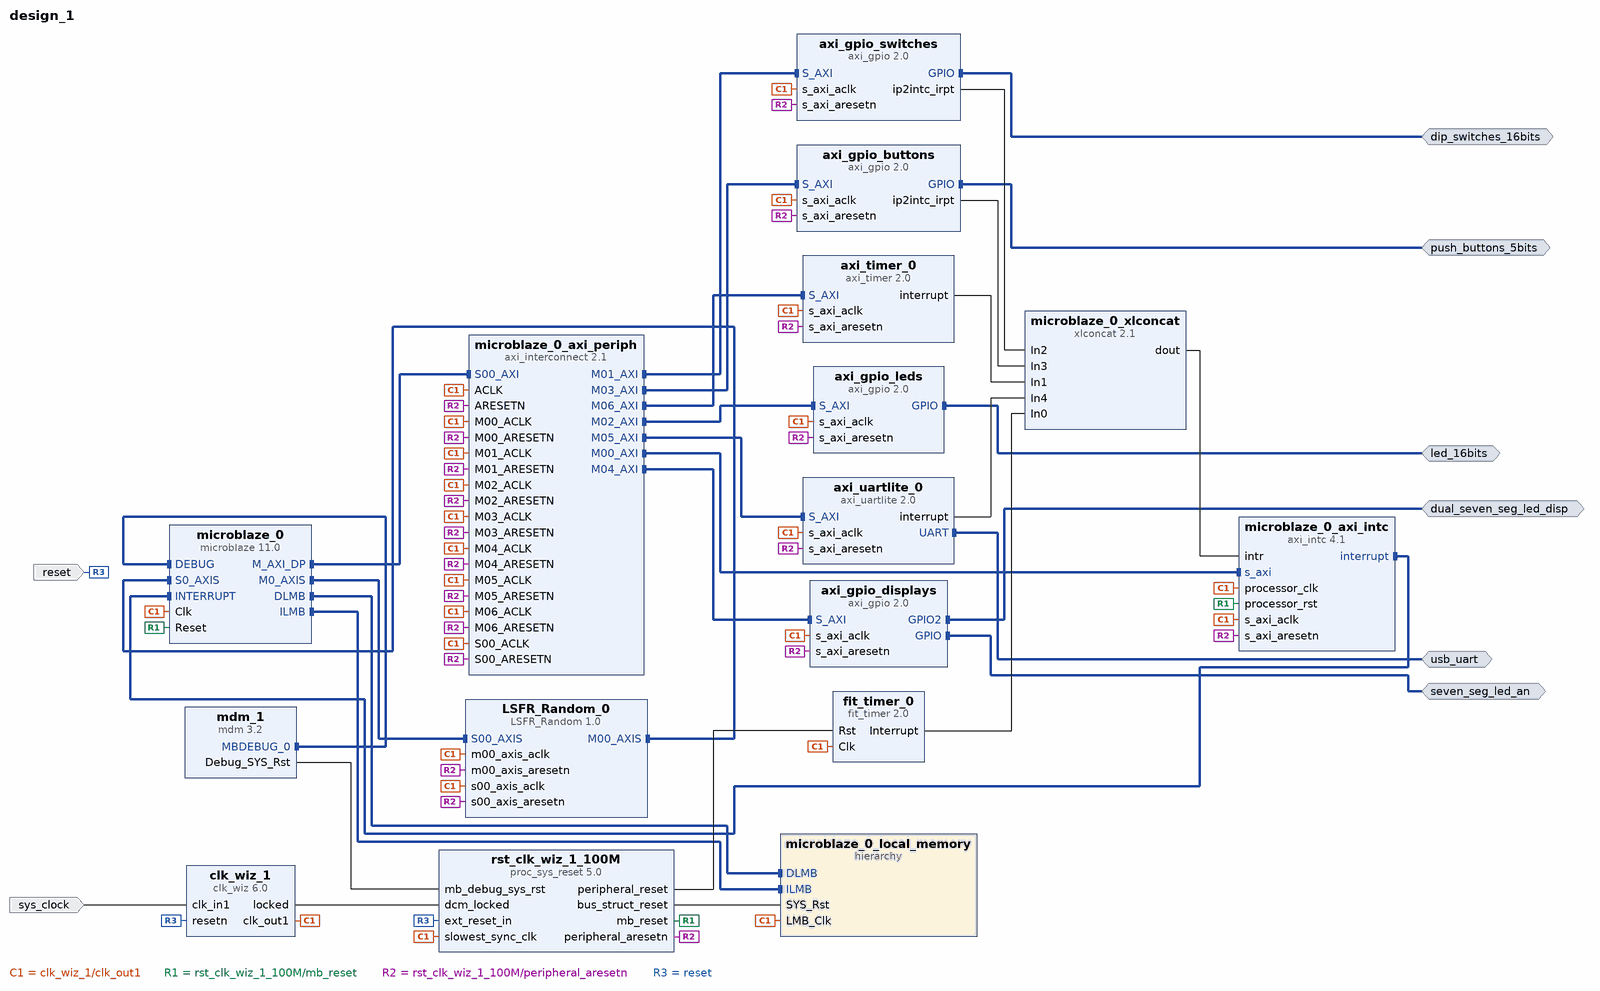
[diagram p0: block diagram of the top level]
# Vivado block design design_1, xc7a100tcsg324-1, Vivado 2020.2
create_bd_design design_1

create_bd_intf_port -mode Master -vlnv xilinx.com:interface:gpio_rtl:1.0 dip_switches_16bits
create_bd_intf_port -mode Master -vlnv xilinx.com:interface:gpio_rtl:1.0 led_16bits
create_bd_intf_port -mode Master -vlnv xilinx.com:interface:gpio_rtl:1.0 push_buttons_5bits
create_bd_intf_port -mode Master -vlnv xilinx.com:interface:gpio_rtl:1.0 seven_seg_led_an
create_bd_intf_port -mode Master -vlnv xilinx.com:interface:gpio_rtl:1.0 dual_seven_seg_led_disp
create_bd_intf_port -mode Master -vlnv xilinx.com:interface:uart_rtl:1.0 usb_uart
create_bd_port -dir I -type clk sys_clock
set_property -dict {CONFIG.FREQ_HZ 100000000 CONFIG.PHASE 0.000} [get_bd_ports sys_clock]
create_bd_port -dir I -type rst reset
set_property -dict {CONFIG.POLARITY ACTIVE_LOW} [get_bd_ports reset]

create_bd_cell -type ip -vlnv xilinx.com:ip:microblaze:11.0 microblaze_0
set_property -dict [list \
  CONFIG.C_DEBUG_ENABLED 1 \
  CONFIG.C_D_AXI 1 \
  CONFIG.C_D_LMB 1 \
  CONFIG.C_FSL_LINKS 1 \
  CONFIG.C_I_LMB 1 \
] [get_bd_cells microblaze_0]
create_bd_cell -type hier microblaze_0_local_memory
create_bd_cell -type ip -vlnv xilinx.com:ip:axi_interconnect:2.1 microblaze_0_axi_periph
set_property -dict {CONFIG.NUM_MI 7} [get_bd_cells microblaze_0_axi_periph]
create_bd_cell -type ip -vlnv xilinx.com:ip:axi_intc:4.1 microblaze_0_axi_intc
set_property -dict {CONFIG.C_HAS_FAST 1} [get_bd_cells microblaze_0_axi_intc]
create_bd_cell -type ip -vlnv xilinx.com:ip:xlconcat:2.1 microblaze_0_xlconcat
set_property -dict {CONFIG.NUM_PORTS 5} [get_bd_cells microblaze_0_xlconcat]
create_bd_cell -type ip -vlnv xilinx.com:ip:mdm:3.2 mdm_1
create_bd_cell -type ip -vlnv xilinx.com:ip:clk_wiz:6.0 clk_wiz_1
set_property -dict [list \
  CONFIG.CLK_IN1_BOARD_INTERFACE sys_clock \
  CONFIG.PRIM_SOURCE Single_ended_clock_capable_pin \
  CONFIG.RESET_BOARD_INTERFACE reset \
  CONFIG.RESET_PORT resetn \
  CONFIG.RESET_TYPE ACTIVE_LOW \
  CONFIG.USE_BOARD_FLOW true \
] [get_bd_cells clk_wiz_1]
create_bd_cell -type ip -vlnv xilinx.com:ip:proc_sys_reset:5.0 rst_clk_wiz_1_100M
set_property -dict {CONFIG.RESET_BOARD_INTERFACE reset CONFIG.USE_BOARD_FLOW true} [get_bd_cells rst_clk_wiz_1_100M]
create_bd_cell -type ip -vlnv xilinx.com:ip:axi_gpio:2.0 axi_gpio_switches
set_property -dict [list \
  CONFIG.C_INTERRUPT_PRESENT 1 \
  CONFIG.C_IS_DUAL 0 \
  CONFIG.GPIO_BOARD_INTERFACE dip_switches_16bits \
  CONFIG.USE_BOARD_FLOW true \
] [get_bd_cells axi_gpio_switches]
create_bd_cell -type ip -vlnv xilinx.com:ip:axi_gpio:2.0 axi_gpio_leds
set_property -dict {CONFIG.GPIO_BOARD_INTERFACE led_16bits CONFIG.USE_BOARD_FLOW true} [get_bd_cells axi_gpio_leds]
create_bd_cell -type ip -vlnv xilinx.com:ip:axi_gpio:2.0 axi_gpio_buttons
set_property -dict [list \
  CONFIG.C_INTERRUPT_PRESENT 1 \
  CONFIG.GPIO_BOARD_INTERFACE push_buttons_5bits \
  CONFIG.USE_BOARD_FLOW true \
] [get_bd_cells axi_gpio_buttons]
create_bd_cell -type ip -vlnv xilinx.com:ip:axi_gpio:2.0 axi_gpio_displays
set_property -dict [list \
  CONFIG.C_DOUT_DEFAULT 0xFFFFFFFF \
  CONFIG.C_DOUT_DEFAULT_2 0xFFFFFFFF \
  CONFIG.GPIO2_BOARD_INTERFACE dual_seven_seg_led_disp \
  CONFIG.GPIO_BOARD_INTERFACE seven_seg_led_an \
  CONFIG.USE_BOARD_FLOW true \
] [get_bd_cells axi_gpio_displays]
create_bd_cell -type ip -vlnv xilinx.com:ip:axi_uartlite:2.0 axi_uartlite_0
set_property -dict {CONFIG.UARTLITE_BOARD_INTERFACE usb_uart CONFIG.USE_BOARD_FLOW true} [get_bd_cells axi_uartlite_0]
create_bd_cell -type ip -vlnv xilinx.com:ip:axi_timer:2.0 axi_timer_0
set_property -dict {CONFIG.enable_timer2 0} [get_bd_cells axi_timer_0]
create_bd_cell -type ip -vlnv xilinx.com:ip:fit_timer:2.0 fit_timer_0
set_property -dict {CONFIG.C_NO_CLOCKS 125000} [get_bd_cells fit_timer_0]
create_bd_cell -type ip -vlnv xilinx.com:user:LSFR_Random:1.0 LSFR_Random_0

# ---- hierarchy /microblaze_0_local_memory ----
current_bd_instance /microblaze_0_local_memory
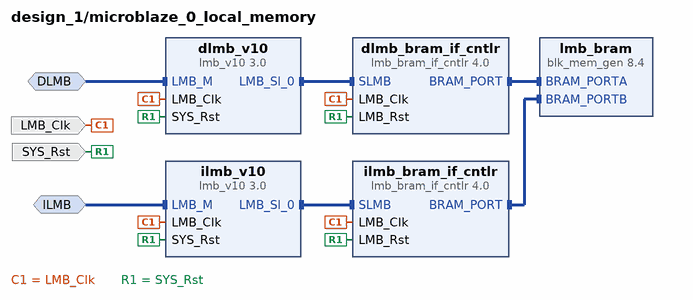
[diagram p1: block diagram inside /microblaze_0_local_memory]
create_bd_intf_pin -mode MirroredMaster -vlnv xilinx.com:interface:lmb_rtl:1.0 DLMB
create_bd_intf_pin -mode MirroredMaster -vlnv xilinx.com:interface:lmb_rtl:1.0 ILMB
create_bd_pin -dir I -type clk LMB_Clk
create_bd_pin -dir I -type rst SYS_Rst

create_bd_cell -type ip -vlnv xilinx.com:ip:lmb_v10:3.0 dlmb_v10
create_bd_cell -type ip -vlnv xilinx.com:ip:lmb_v10:3.0 ilmb_v10
create_bd_cell -type ip -vlnv xilinx.com:ip:lmb_bram_if_cntlr:4.0 dlmb_bram_if_cntlr
set_property -dict {CONFIG.C_ECC 0} [get_bd_cells dlmb_bram_if_cntlr]
create_bd_cell -type ip -vlnv xilinx.com:ip:lmb_bram_if_cntlr:4.0 ilmb_bram_if_cntlr
set_property -dict {CONFIG.C_ECC 0} [get_bd_cells ilmb_bram_if_cntlr]
create_bd_cell -type ip -vlnv xilinx.com:ip:blk_mem_gen:8.4 lmb_bram
set_property -dict [list \
  CONFIG.Memory_Type True_Dual_Port_RAM \
  CONFIG.Port_A_Clock 100 \
  CONFIG.use_bram_block BRAM_Controller \
] [get_bd_cells lmb_bram]

# ---- connections ----

current_bd_instance /microblaze_0_local_memory
connect_bd_intf_net -intf_net microblaze_0_ilmb [get_bd_intf_pins ILMB] [get_bd_intf_pins ilmb_v10/LMB_M]
connect_bd_intf_net -intf_net microblaze_0_ilmb_bus [get_bd_intf_pins ilmb_v10/LMB_Sl_0] [get_bd_intf_pins ilmb_bram_if_cntlr/SLMB]
connect_bd_intf_net -intf_net microblaze_0_dlmb_cntlr [get_bd_intf_pins dlmb_bram_if_cntlr/BRAM_PORT] [get_bd_intf_pins lmb_bram/BRAM_PORTA]
connect_bd_intf_net -intf_net microblaze_0_dlmb_bus [get_bd_intf_pins dlmb_v10/LMB_Sl_0] [get_bd_intf_pins dlmb_bram_if_cntlr/SLMB]
connect_bd_intf_net -intf_net microblaze_0_ilmb_cntlr [get_bd_intf_pins ilmb_bram_if_cntlr/BRAM_PORT] [get_bd_intf_pins lmb_bram/BRAM_PORTB]
connect_bd_intf_net -intf_net microblaze_0_dlmb [get_bd_intf_pins DLMB] [get_bd_intf_pins dlmb_v10/LMB_M]
connect_bd_net -net microblaze_0_Clk [get_bd_pins LMB_Clk] \
  [get_bd_pins dlmb_v10/LMB_Clk] [get_bd_pins dlmb_bram_if_cntlr/LMB_Clk] [get_bd_pins ilmb_v10/LMB_Clk] \
  [get_bd_pins ilmb_bram_if_cntlr/LMB_Clk]
connect_bd_net [get_bd_pins SYS_Rst] \
  [get_bd_pins dlmb_v10/SYS_Rst] [get_bd_pins dlmb_bram_if_cntlr/LMB_Rst] [get_bd_pins ilmb_v10/SYS_Rst] \
  [get_bd_pins ilmb_bram_if_cntlr/LMB_Rst]
set_property HDL_ATTRIBUTE.BMM_INFO_ADDRESS_SPACE {byte  0x00000000 32 > design_1 microblaze_0_local_memory/lmb_bram} [get_bd_cells dlmb_bram_if_cntlr]
set_property HDL_ATTRIBUTE.KEEP_HIERARCHY yes [get_bd_cells dlmb_bram_if_cntlr]

current_bd_instance /
connect_bd_intf_net [get_bd_intf_pins microblaze_0/DLMB] [get_bd_intf_pins microblaze_0_local_memory/DLMB]
connect_bd_intf_net [get_bd_intf_pins microblaze_0_axi_periph/M06_AXI] [get_bd_intf_pins axi_timer_0/S_AXI]
connect_bd_intf_net [get_bd_intf_pins microblaze_0/ILMB] [get_bd_intf_pins microblaze_0_local_memory/ILMB]
connect_bd_intf_net [get_bd_intf_pins LSFR_Random_0/S00_AXIS] [get_bd_intf_pins microblaze_0/M0_AXIS]
connect_bd_intf_net [get_bd_intf_pins microblaze_0_axi_periph/M01_AXI] [get_bd_intf_pins axi_gpio_switches/S_AXI]
connect_bd_intf_net [get_bd_intf_pins microblaze_0_axi_periph/M04_AXI] [get_bd_intf_pins axi_gpio_displays/S_AXI]
connect_bd_intf_net -intf_net axi_gpio_1_GPIO [get_bd_intf_ports led_16bits] [get_bd_intf_pins axi_gpio_leds/GPIO]
connect_bd_intf_net [get_bd_intf_pins mdm_1/MBDEBUG_0] [get_bd_intf_pins microblaze_0/DEBUG]
connect_bd_intf_net [get_bd_intf_pins microblaze_0_axi_periph/M03_AXI] [get_bd_intf_pins axi_gpio_buttons/S_AXI]
connect_bd_intf_net [get_bd_intf_pins microblaze_0_axi_periph/M02_AXI] [get_bd_intf_pins axi_gpio_leds/S_AXI]
connect_bd_intf_net [get_bd_intf_pins LSFR_Random_0/M00_AXIS] [get_bd_intf_pins microblaze_0/S0_AXIS]
connect_bd_intf_net -intf_net axi_gpio_0_GPIO [get_bd_intf_ports dip_switches_16bits] [get_bd_intf_pins axi_gpio_switches/GPIO]
connect_bd_intf_net -intf_net microblaze_0_intc_axi [get_bd_intf_pins microblaze_0_axi_periph/M00_AXI] [get_bd_intf_pins microblaze_0_axi_intc/s_axi]
connect_bd_intf_net [get_bd_intf_ports usb_uart] [get_bd_intf_pins axi_uartlite_0/UART]
connect_bd_intf_net [get_bd_intf_pins microblaze_0_axi_intc/interrupt] [get_bd_intf_pins microblaze_0/INTERRUPT]
connect_bd_intf_net -intf_net axi_gpio_3_GPIO [get_bd_intf_ports seven_seg_led_an] [get_bd_intf_pins axi_gpio_displays/GPIO]
connect_bd_intf_net -intf_net axi_gpio_3_GPIO2 [get_bd_intf_ports dual_seven_seg_led_disp] [get_bd_intf_pins axi_gpio_displays/GPIO2]
connect_bd_intf_net [get_bd_intf_pins microblaze_0_axi_periph/M05_AXI] [get_bd_intf_pins axi_uartlite_0/S_AXI]
connect_bd_intf_net -intf_net microblaze_0_axi_dp [get_bd_intf_pins microblaze_0_axi_periph/S00_AXI] [get_bd_intf_pins microblaze_0/M_AXI_DP]
connect_bd_intf_net -intf_net axi_gpio_2_GPIO [get_bd_intf_ports push_buttons_5bits] [get_bd_intf_pins axi_gpio_buttons/GPIO]
connect_bd_net -net microblaze_0_intr [get_bd_pins microblaze_0_xlconcat/dout] [get_bd_pins microblaze_0_axi_intc/intr]
connect_bd_net -net microblaze_0_Clk [get_bd_pins clk_wiz_1/clk_out1] \
  [get_bd_pins microblaze_0/Clk] [get_bd_pins microblaze_0_axi_periph/ACLK] [get_bd_pins microblaze_0_axi_periph/S00_ACLK] \
  [get_bd_pins microblaze_0_axi_periph/M00_ACLK] [get_bd_pins microblaze_0_axi_intc/s_axi_aclk] \
  [get_bd_pins microblaze_0_axi_intc/processor_clk] [get_bd_pins microblaze_0_local_memory/LMB_Clk] \
  [get_bd_pins rst_clk_wiz_1_100M/slowest_sync_clk] [get_bd_pins axi_gpio_switches/s_axi_aclk] \
  [get_bd_pins microblaze_0_axi_periph/M01_ACLK] [get_bd_pins axi_gpio_leds/s_axi_aclk] \
  [get_bd_pins microblaze_0_axi_periph/M02_ACLK] [get_bd_pins axi_gpio_buttons/s_axi_aclk] \
  [get_bd_pins microblaze_0_axi_periph/M03_ACLK] [get_bd_pins axi_gpio_displays/s_axi_aclk] \
  [get_bd_pins microblaze_0_axi_periph/M04_ACLK] [get_bd_pins axi_uartlite_0/s_axi_aclk] \
  [get_bd_pins microblaze_0_axi_periph/M05_ACLK] [get_bd_pins axi_timer_0/s_axi_aclk] \
  [get_bd_pins microblaze_0_axi_periph/M06_ACLK] [get_bd_pins fit_timer_0/Clk] [get_bd_pins LSFR_Random_0/s00_axis_aclk] \
  [get_bd_pins LSFR_Random_0/m00_axis_aclk]
connect_bd_net [get_bd_pins clk_wiz_1/locked] [get_bd_pins rst_clk_wiz_1_100M/dcm_locked]
connect_bd_net [get_bd_pins rst_clk_wiz_1_100M/mb_reset] [get_bd_pins microblaze_0/Reset] [get_bd_pins microblaze_0_axi_intc/processor_rst]
connect_bd_net [get_bd_pins rst_clk_wiz_1_100M/bus_struct_reset] [get_bd_pins microblaze_0_local_memory/SYS_Rst]
connect_bd_net [get_bd_pins rst_clk_wiz_1_100M/peripheral_aresetn] \
  [get_bd_pins microblaze_0_axi_periph/ARESETN] [get_bd_pins microblaze_0_axi_periph/S00_ARESETN] \
  [get_bd_pins microblaze_0_axi_periph/M00_ARESETN] [get_bd_pins microblaze_0_axi_intc/s_axi_aresetn] \
  [get_bd_pins axi_gpio_switches/s_axi_aresetn] [get_bd_pins microblaze_0_axi_periph/M01_ARESETN] \
  [get_bd_pins axi_gpio_leds/s_axi_aresetn] [get_bd_pins microblaze_0_axi_periph/M02_ARESETN] \
  [get_bd_pins axi_gpio_buttons/s_axi_aresetn] [get_bd_pins microblaze_0_axi_periph/M03_ARESETN] \
  [get_bd_pins axi_gpio_displays/s_axi_aresetn] [get_bd_pins microblaze_0_axi_periph/M04_ARESETN] \
  [get_bd_pins axi_uartlite_0/s_axi_aresetn] [get_bd_pins microblaze_0_axi_periph/M05_ARESETN] \
  [get_bd_pins axi_timer_0/s_axi_aresetn] [get_bd_pins microblaze_0_axi_periph/M06_ARESETN] \
  [get_bd_pins LSFR_Random_0/s00_axis_aresetn] [get_bd_pins LSFR_Random_0/m00_axis_aresetn]
connect_bd_net [get_bd_pins mdm_1/Debug_SYS_Rst] [get_bd_pins rst_clk_wiz_1_100M/mb_debug_sys_rst]
connect_bd_net [get_bd_ports sys_clock] [get_bd_pins clk_wiz_1/clk_in1]
connect_bd_net [get_bd_ports reset] [get_bd_pins clk_wiz_1/resetn] [get_bd_pins rst_clk_wiz_1_100M/ext_reset_in]
connect_bd_net [get_bd_pins rst_clk_wiz_1_100M/peripheral_reset] [get_bd_pins fit_timer_0/Rst]
connect_bd_net [get_bd_pins fit_timer_0/Interrupt] [get_bd_pins microblaze_0_xlconcat/In0]
connect_bd_net [get_bd_pins axi_timer_0/interrupt] [get_bd_pins microblaze_0_xlconcat/In1]
connect_bd_net [get_bd_pins axi_gpio_switches/ip2intc_irpt] [get_bd_pins microblaze_0_xlconcat/In2]
connect_bd_net [get_bd_pins axi_gpio_buttons/ip2intc_irpt] [get_bd_pins microblaze_0_xlconcat/In3]
connect_bd_net [get_bd_pins axi_uartlite_0/interrupt] [get_bd_pins microblaze_0_xlconcat/In4]
set_property HDL_ATTRIBUTE.BMM_INFO_PROCESSOR {microblaze-le > design_1 microblaze_0_local_memory/dlmb_bram_if_cntlr} [get_bd_cells microblaze_0]
set_property HDL_ATTRIBUTE.KEEP_HIERARCHY yes [get_bd_cells microblaze_0]

# ---- address map ----
assign_bd_address -offset 0x00000000 -range 64K -target_address_space [get_bd_addr_spaces microblaze_0/Data] [get_bd_addr_segs microblaze_0_local_memory/dlmb_bram_if_cntlr/SLMB/Mem]
assign_bd_address -offset 0x40000000 -range 64K -target_address_space [get_bd_addr_spaces microblaze_0/Data] [get_bd_addr_segs axi_gpio_switches/S_AXI/Reg]
assign_bd_address -offset 0x40010000 -range 64K -target_address_space [get_bd_addr_spaces microblaze_0/Data] [get_bd_addr_segs axi_gpio_leds/S_AXI/Reg]
assign_bd_address -offset 0x40020000 -range 64K -target_address_space [get_bd_addr_spaces microblaze_0/Data] [get_bd_addr_segs axi_gpio_buttons/S_AXI/Reg]
assign_bd_address -offset 0x40030000 -range 64K -target_address_space [get_bd_addr_spaces microblaze_0/Data] [get_bd_addr_segs axi_gpio_displays/S_AXI/Reg]
assign_bd_address -offset 0x40600000 -range 64K -target_address_space [get_bd_addr_spaces microblaze_0/Data] [get_bd_addr_segs axi_uartlite_0/S_AXI/Reg]
assign_bd_address -offset 0x41200000 -range 64K -target_address_space [get_bd_addr_spaces microblaze_0/Data] [get_bd_addr_segs microblaze_0_axi_intc/S_AXI/Reg]
assign_bd_address -offset 0x41C00000 -range 64K -target_address_space [get_bd_addr_spaces microblaze_0/Data] [get_bd_addr_segs axi_timer_0/S_AXI/Reg]
assign_bd_address -offset 0x00000000 -range 64K -target_address_space [get_bd_addr_spaces microblaze_0/Instruction] [get_bd_addr_segs microblaze_0_local_memory/ilmb_bram_if_cntlr/SLMB/Mem]

validate_bd_design
save_bd_design
